# EasyEDA Pro project 第十四届蓝桥杯省赛真题.eprj, board B1
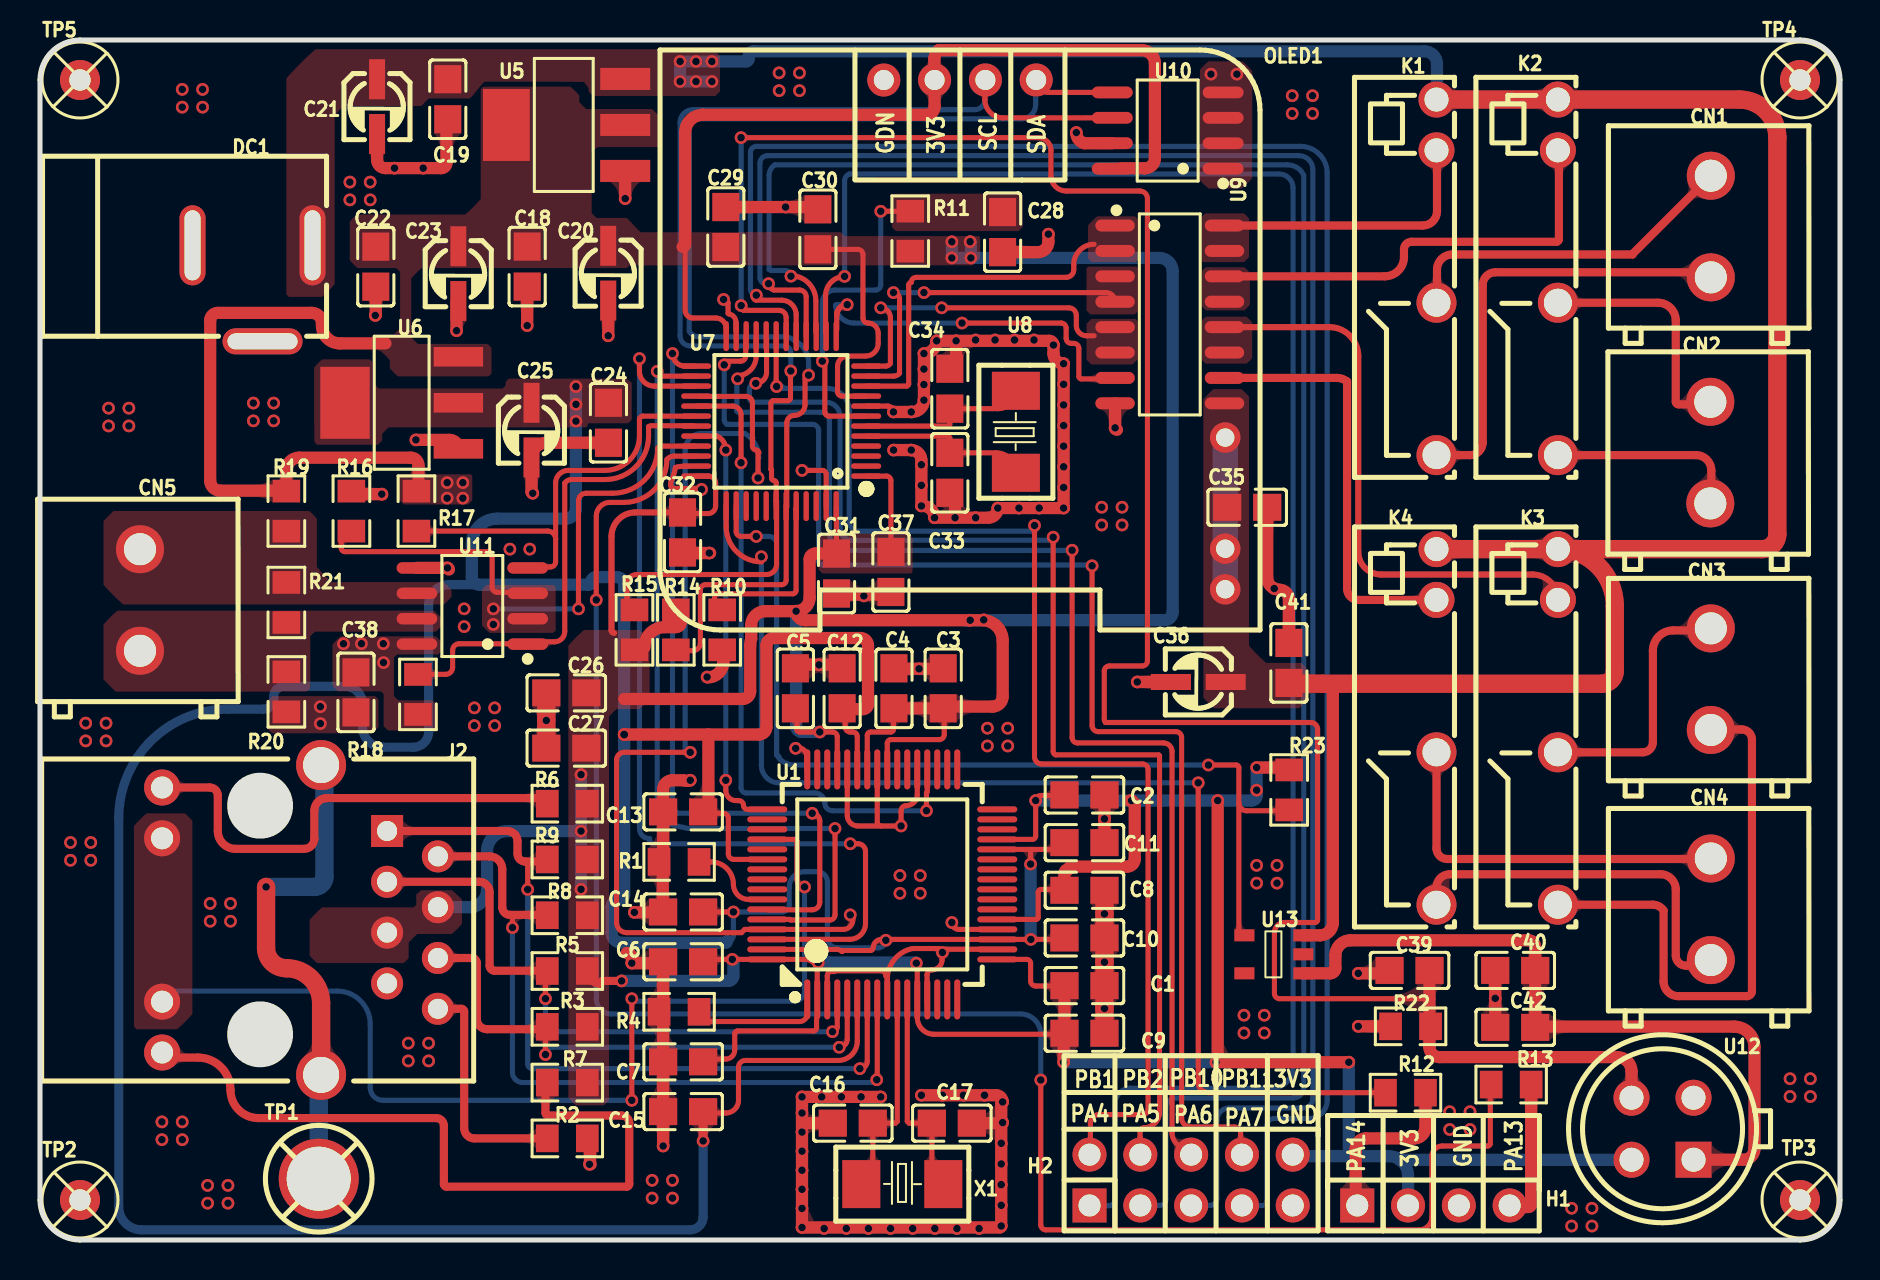
[diagram p2: board, top side]
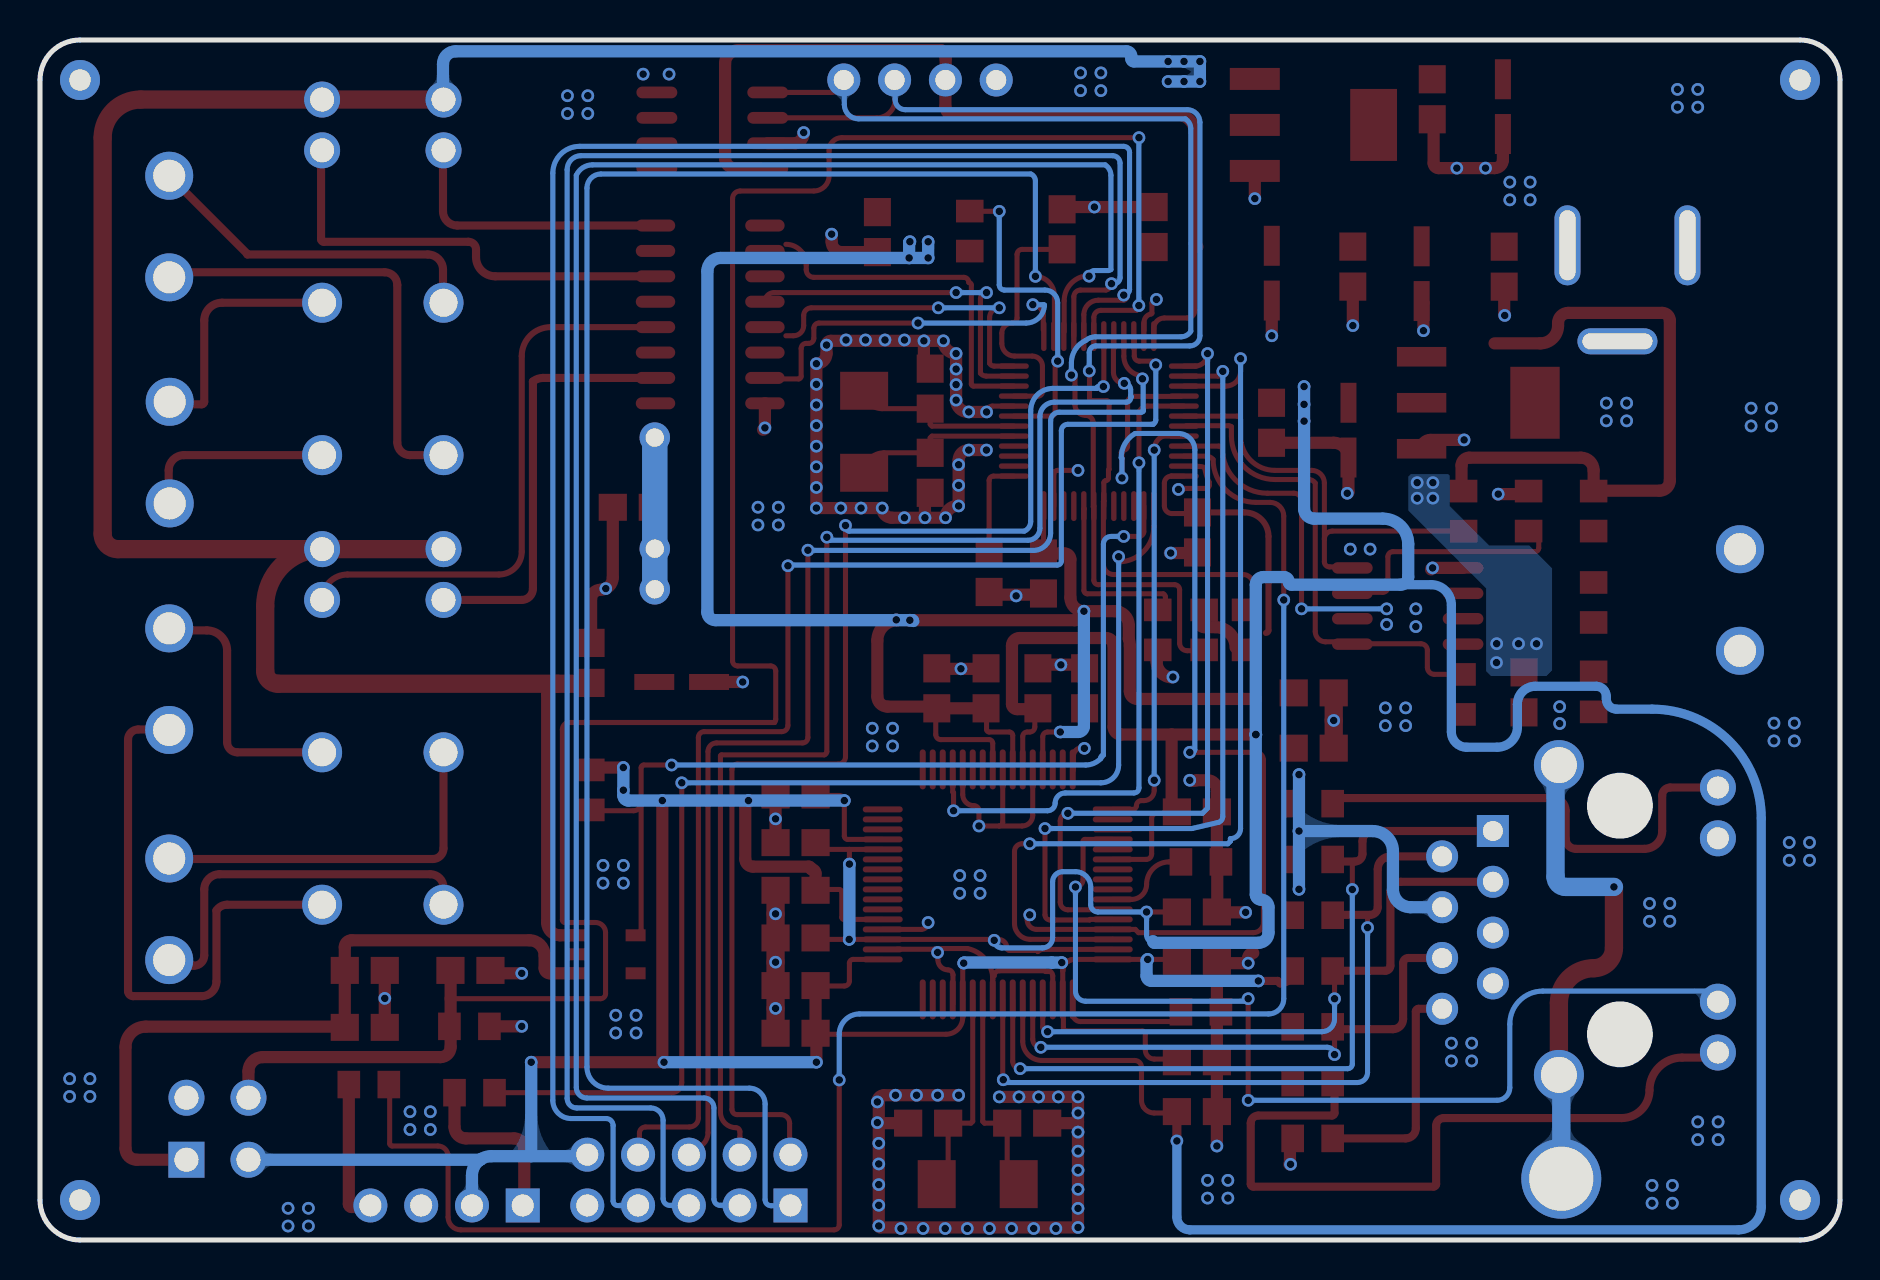
[diagram p3: board, bottom side, seen from below]

Outline 90 x 60 mm; copper layers: Top Layer, Bottom Layer. Coordinates in mm from the lower left corner of the outline.
Outline path: 0,58 0,2 arc(0.59,0.59) 2,0 88,0 arc(89.41,0.59) 90,2 90,58 arc(89.41,59.41) 88,60 2,60 arc(0.59,59.41) 0,58
Stack: Top Layer 0.035mm / Dielectric1 1.51mm FR4 er 4.5 / Bottom Layer 0.035mm

## Design rules (mm)
net XO: DP1
net XI: DP1
net M_X1: DP2
net M_X2: DP2
template: 用户自定义配置
spacing safeClearance (default): track to track 0.203, other pairs 0.152 to 0.203
track width trackWidth (default): min 0.254, default 0.254, max 2.54
track width PWR: min 0.254, default 0.61, max 2.54
differential pair differentialPair (default): width min 0.127, default 0.254, max 2.54; gap min 0.152, default 0.152
via viaSize (default): diameter min 0.635, default 0.635, max 10; hole min 0.381, default 0.381, max 5.999
net 3V3 uses PWR
net GND uses PWR
net 1V8 uses PWR
net DC uses PWR

## Placement (name value [footprint] x y rotation side)
C1  100nF  [C0805]  52.22 12.72 0 top
C2  100nF  [C0805]  52.22 22.25 0 top
C3  100nF  [C0805]  45.16 27.58 90 top
C4  100nF  [C0805]  42.7 27.58 90 top
C5  100nF  [C0805]  37.77 27.58 90 top
C6  100nF  [C0805]  32.16 13.91 180 top
C7  100nF  [C0805]  32.16 8.91 180 top
C8  100nF  [C0805]  52.22 17.49 0 top
C9  100nF  [C0805]  52.22 10.34 0 top
C10  100nF  [C0805]  52.22 15.1 0 top
C11  100nF  [C0805]  52.22 19.87 0 top
C12  100nF  [C0805]  40.11 27.58 90 top
C13  100nF  [C0805]  32.16 21.41 180 top
C14  100nF  [C0805]  32.16 16.4 180 top
C15  100nF  [C0805]  32.16 6.42 180 top
C16  20pF  [C0805]  40.64 5.84 0 top
C17  20pF  [C0805]  45.59 5.84 180 top
C18  100nF  [C0805]  24.36 48.67 270 top
C19  100nF  [C0805]  20.39 57.04 270 top
C20  10uF  [C_Ele_SMD_3x5.4mm]  28.4 48.34 90 top
C21  10uF  [C_Ele_SMD_3x5.4mm]  16.84 56.66 90 top
C22  100nF  [C0805]  16.79 48.67 270 top
C23  10uF  [C_Ele_SMD_3x5.4mm]  20.9 48.31 90 top
C24  100nF  [C0805]  28.42 40.86 270 top
C25  10uF  [C_Ele_SMD_3x5.4mm]  24.56 40.49 90 top
C26  100nF  [C0805]  26.31 27.36 180 top
C27  10nF  [C0805]  26.31 24.59 180 top
C28  100nF  [C0805]  48.13 50.39 270 top
C29  100nF  [C0805]  34.29 50.65 90 top
C30  100nF  [C0805]  38.89 50.53 90 top
C31  100nF  [C0805]  39.83 33.33 270 top
C32  100nF  [C0805]  32.13 35.38 270 top
C33  20p  [C0805]  45.49 38.36 90 top
C34  20p  [C0805]  45.49 42.57 270 top
C35  100nF  [C0805]  60.36 36.64 0 top
C36  10uF  [C_Ele_SMD_3x5.4mm]  57.91 27.91 0 top
C37  100nF  [C0805]  42.54 33.4 90 top
C38  100nF  [C0805]  15.8 27.38 90 top
C39  100nF  [C0805]  68.48 13.48 180 top
C40  100nF  [C0805]  73.76 13.48 0 top
C41  100nF  [C0805]  62.44 28.85 90 top
C42  10nF  [C0805]  73.76 10.63 0 top
CN1  KF128L-5.08-2P 蓝色  [TH_KF128L-5.08-2P]  83.54 50.67 270 top
CN2  KF128L-5.08-2P 蓝色  [TH_KF128L-5.08-2P]  83.51 39.37 270 top
CN3  KF128L-5.08-2P 蓝色  [TH_KF128L-5.08-2P]  83.54 28.04 270 top
CN4  KF128L-5.08-2P 蓝色  [TH_KF128L-5.08-2P]  83.54 16.54 270 top
CN5  KF128L-5.08-2P 蓝色  [TH_KF128L-5.08-2P]  5 32 270 top
DC1  -  [DC-2.0]  10.5 50 180 top
H1  -  [HDR-TH_4P-P2.54-V-F]  69.67 1.73 0 top
H2  -  [HDR-TH_10P-P2.54-V-M-R2-C5-S2.54]  57.56 3 0 top
J2  HY911105AE  [RJ45-TH_HR911105A]  13 16 270 top
K1  HF49FD/012-1H12  [RELAY-TH_HF49FD-XXX-1H12-XXX]  69.82 48.13 270 top
K2  HF49FD/012-1H12  [RELAY-TH_HF49FD-XXX-1H12-XXX]  75.9 48.13 270 top
K3  HF49FD/012-1H12  [RELAY-TH_HF49FD-XXX-1H12-XXX]  75.9 25.65 270 top
K4  HF49FD/012-1H12  [RELAY-TH_HF49FD-XXX-1H12-XXX]  69.82 25.65 270 top
NOREF  -  [Pad_e674]  59.26 32.54 0 top
NOREF#2  -  [Pad_e675]  59.26 40.12 0 top
NOREF#3  -  [Pad_e663]  59.26 34.57 0 top
OLED1  -  [0.96OLED_4P]  46 58 0 top
R1  0R  [R0805]  31.95 18.9 180 top
R2  0R  [R0805]  26.37 5.08 0 top
R3  49R9  [R0805]  26.37 10.66 0 top
R4  12K  [R0805]  31.95 11.41 180 top
R5  49R9  [R0805]  26.37 13.45 0 top
R6  300R  [R0805]  26.37 21.82 0 top
R7  300R  [R0805]  26.37 7.87 0 top
R8  49R9  [R0805]  26.37 16.24 0 top
R9  49R9  [R0805]  26.37 19.03 0 top
R10  10K  [R0805]  34.11 30.51 90 top
R11  12K  [R0805]  43.51 50.45 270 top
R12  100R  [R0805]  68.28 7.37 180 top
R13  100R  [R0805]  73.56 7.77 180 top
R14  10K  [R0805]  31.79 30.51 90 top
R15  10K  [R0805]  29.72 30.51 90 top
R16  12K  [R0805]  15.57 36.45 90 top
R17  12K  [R0805]  18.82 36.45 90 top
R18  12K  [R0805]  18.9 27.28 90 top
R19  NC  [R0805]  12.32 36.45 90 top
R20  NC  [R0805]  12.32 27.41 90 top
R21  NC  [R0805]  12.32 31.88 90 top
R22  10K  [R0805]  68.53 10.68 180 top
R23  10K  [R0805]  62.46 22.5 270 top
TP1  -  [M3螺丝]  14 3 0 top
TP2  -  [M2螺丝]  2 2 0 top
TP3  -  [M2螺丝]  88 2 0 top
TP4  -  [M2螺丝]  88 58 0 top
TP5  -  [M2螺丝]  2 58 0 top
U1  CH395Q  [LQFP-64_L10.0-W10.0-P0.50-LS12.0-BL]  42.11 17.78 0 top
U5  AMS1117-3.3  [SOT-223-3_L6.5-W3.4-P2.30-LS7.0-BR]  26.29 55.75 0 top
U6  AMS1117-1.8  [SOT-223-4_L6.5-W3.5-P2.30-LS7.0-BR]  18.08 41.86 0 top
U7  GD32F303CBT6  [LQFP-48_L7.0-W7.0-P0.50-LS9.0-BL]  37.06 40.94 90 top
U8  8M-5032-2P  [CRYSTAL-SMD_L5.0-W3.2]  48.79 40.41 270 top
U9  ULN2003  [SOIC-16_L9.9-W3.9-P1.27-LS6.0-BL]  56.49 46.28 270 top
U10  M24C02-WMN6TP  [SOIC-8_L4.9-W3.9-P1.27-LS6.0-BL]  56.38 55.47 90 top
U11  MAX3485ESA  [SOP-8_L5.0-W4.0-P1.27-LS6.0-BL]  21.62 31.7 90 top
U12  MP-2  [SENSOR-TH_MP-5]  81.13 5.56 90 top
U13  -  [SOT_PDS]  63.17 13.33 90 top
X1  30MHz  [OSC-SMD_L5.0-W3.2]  43.12 2.79 180 top

## Footprints (pads in the part's own frame, mm; a bottom-side part is the same pattern mirrored in y, then rotated)
0.96OLED_4P
  round 1.65 hole 1: 1(-3.81,-0.002) 2(-1.27,0.002) 3(1.27,0.002) 4(3.81,0.002)
C0805
  rect 1.41x1.35 smd: 1(-1,0) 2(1,0)
C_Ele_SMD_3x5.4mm
  rect 1.999x0.8 smd: 1(1.374,-0.014) 2(-1.364,-0.014)
CRYSTAL-SMD_L5.0-W3.2
  rect 1.9x2.4 smd: 1(-2.05,0) 2(2.05,0)
DC-2.0
  oval 4x1.3 hole 3.5x0.8: 2(-0.627,5.067)
  oval 1.3x4 hole 0.8x3.5: 3(2.873,0.267) 4(-3.127,0.267)
HDR-TH_4P-P2.54-V-F
  rect 1.7x1.7 hole 1.1: 1(-3.81,0)
  round 1.7 hole 1.1: 2(-1.27,0) 3(1.27,0) 4(3.81,0)
HDR-TH_10P-P2.54-V-M-R2-C5-S2.54
  rect 1.7x1.7 hole 1.1: 1(-5.08,-1.27)
  round 1.7 hole 1.1: 2(-5.08,1.27) 3(-2.54,-1.27) 4(-2.54,1.27) 5(0,-1.27) 6(0,1.27) 7(2.54,-1.27) 8(2.54,1.27) 9(5.08,-1.27) 10(5.08,1.27)
LQFP-48_L7.0-W7.0-P0.50-LS9.0-BL
  oval 0.27x1.5 smd: 1(-2.75,-4.25) 2(-2.25,-4.25) 3(-1.75,-4.25) 4(-1.25,-4.25) 5(-0.75,-4.25) 6(-0.25,-4.25) 7(0.25,-4.25) 8(0.75,-4.25) 9(1.25,-4.25) 10(1.75,-4.25) 11(2.25,-4.25) 12(2.75,-4.25) 25(2.75,4.25) 26(2.25,4.25) 27(1.75,4.25) 28(1.25,4.25) 29(0.75,4.25) 30(0.25,4.25) 31(-0.25,4.25) 32(-0.75,4.25) 33(-1.25,4.25) 34(-1.75,4.25) 35(-2.25,4.25) 36(-2.75,4.25)
  oval 1.5x0.27 smd: 13(4.25,-2.75) 14(4.25,-2.25) 15(4.25,-1.75) 16(4.25,-1.25) 17(4.25,-0.75) 18(4.25,-0.25) 19(4.25,0.25) 20(4.25,0.75) 21(4.25,1.25) 22(4.25,1.75) 23(4.25,2.25) 24(4.25,2.75) 37(-4.25,2.75) 38(-4.25,2.25) 39(-4.25,1.75) 40(-4.25,1.25) 41(-4.25,0.75) 42(-4.25,0.25) 43(-4.25,-0.25) 44(-4.25,-0.75) 45(-4.25,-1.25) 46(-4.25,-1.75) 47(-4.25,-2.25) 48(-4.25,-2.75)
LQFP-64_L10.0-W10.0-P0.50-LS12.0-BL
  oval 0.3x2 smd: 1(-3.75,-5.75) 2(-3.25,-5.75) 3(-2.75,-5.75) 4(-2.25,-5.75) 5(-1.75,-5.75) 6(-1.25,-5.75) 7(-0.75,-5.75) 8(-0.25,-5.75) 9(0.25,-5.75) 10(0.75,-5.75) 11(1.25,-5.75) 12(1.75,-5.75) 13(2.25,-5.75) 14(2.75,-5.75) 15(3.25,-5.75) 16(3.75,-5.75) 33(3.75,5.75) 34(3.25,5.75) 35(2.75,5.75) 36(2.25,5.75) 37(1.75,5.75) 38(1.25,5.75) 39(0.75,5.75) 40(0.25,5.75) 41(-0.25,5.75) 42(-0.75,5.75) 43(-1.25,5.75) 44(-1.75,5.75) 45(-2.25,5.75) 46(-2.75,5.75) 47(-3.25,5.75) 48(-3.75,5.75)
  oval 2x0.3 smd: 17(5.75,-3.75) 18(5.75,-3.25) 19(5.75,-2.75) 20(5.75,-2.25) 21(5.75,-1.75) 22(5.75,-1.25) 23(5.75,-0.75) 24(5.75,-0.25) 25(5.75,0.25) 26(5.75,0.75) 27(5.75,1.25) 28(5.75,1.75) 29(5.75,2.25) 30(5.75,2.75) 31(5.75,3.25) 32(5.75,3.75) 49(-5.75,3.75) 50(-5.75,3.25) 51(-5.75,2.75) 52(-5.75,2.25) 53(-5.75,1.75) 54(-5.75,1.25) 55(-5.75,0.75) 56(-5.75,0.25) 57(-5.75,-0.25) 58(-5.75,-0.75) 59(-5.75,-1.25) 60(-5.75,-1.75) 61(-5.75,-2.25) 62(-5.75,-2.75) 63(-5.75,-3.25) 64(-5.75,-3.75)
M2螺丝
  round 2 hole 1.07: 1(0,0)
M3螺丝
  round 4 hole 3.2: 1(-0.064,0.064)
OSC-SMD_L5.0-W3.2
  rect 1.9x2.4 smd: 1(-2.05,0) 2(2.05,0)
Pad_e663
  round 1.524 hole 0.914: 65(0,0)
Pad_e674
  round 1.524 hole 0.914: 66(0,0)
Pad_e675
  round 1.524 hole 0.914: 67(0,0)
R0805
  rect 1.133x1.377 smd: 1(-1,0) 2(1,0)
RELAY-TH_HF49FD-XXX-1H12-XXX
  round 1.8 hole 1.2: 1(-8.89,0) 2(-6.35,0)
  round 2 hole 1.4: 3(1.27,0) 4(8.89,0)
RJ45-TH_HR911105A
  rect 1.6x1.6 hole 1: 1(-4.45,4.355)
  round 1.6 hole 1: 2(-3.18,6.895) 3(-1.91,4.355) 4(-0.64,6.895) 5(0.63,4.355) 6(1.9,6.895) 7(3.17,4.355) 8(4.44,6.895)
  round 1.8 hole 1.1: 9(-6.625,-6.895) 10(-4.085,-6.895) 11(4.085,-6.895) 12(6.625,-6.895)
  round 2.5 hole 1.8: SH1(-7.745,1.055) SH2(7.745,1.055)
SENSOR-TH_MP-5
  rect 1.8x1.8 hole 1.2: 1(-1.549,-1.55)
  round 1.8 hole 1.2: 2(1.55,-1.55) 3(-1.55,1.55) 4(1.55,1.55)
SOIC-8_L4.9-W3.9-P1.27-LS6.0-BL
  oval 0.588x2.045 smd: 1(-1.905,-2.772) 2(-0.635,-2.772) 3(0.635,-2.772) 4(1.905,-2.772) 5(1.905,2.772) 6(0.635,2.772) 7(-0.635,2.772) 8(-1.905,2.772)
SOIC-16_L9.9-W3.9-P1.27-LS6.0-BL
  oval 0.602x1.971 smd: 1(-4.445,-2.736) 2(-3.175,-2.736) 3(-1.905,-2.736) 4(-0.635,-2.736) 5(0.635,-2.736) 6(1.905,-2.736) 7(3.175,-2.736) 8(4.445,-2.736) 9(4.445,2.736) 10(3.175,2.736) 11(1.905,2.736) 12(0.635,2.736) 13(-0.635,2.736) 14(-1.905,2.736) 15(-3.175,2.736) 16(-4.445,2.736)
SOP-8_L5.0-W4.0-P1.27-LS6.0-BL
  oval 0.574x2.035 smd: 1(-1.905,-2.768) 2(-0.635,-2.768) 3(0.635,-2.768) 4(1.905,-2.768) 5(1.905,2.768) 6(0.635,2.768) 7(-0.635,2.768) 8(-1.905,2.768)
SOT-223-3_L6.5-W3.4-P2.30-LS7.0-BR
  rect 2.5x1.1 smd: 1(2.97,-2.3) 2(2.97,0) 3(2.97,2.3)
  rect 2.34x3.6 smd: 4(-2.97,0)
SOT-223-4_L6.5-W3.5-P2.30-LS7.0-BR
  rect 2.47x0.98 smd: 1(2.835,-2.3) 2(2.835,0) 3(2.835,2.3)
  rect 2.47x3.6 smd: 4(-2.835,0)
SOT_PDS
  rect 0.6x1 smd: 1(0,0) 2(0.95,0) 3(1.9,0) 4(1.9,2.95) 5(0,2.95)
TH_KF128L-5.08-2P
  round 2.4 hole 1.6: 1(-2.54,0) 2(2.54,0)

## Nets
As in the schematic, except:
3V3: C1.1 C2.1 C3.1 C4.1 C5.1 C6.1 C7.1 C8.1 C9.1 C18.1 C20.1 C22.1 C23.1 C26.1 C27.1 C29.1 C30.1 C31.1 C32.1 C37.2 C38.2 H1.2 H2.10 J2.4 J2.5 OLED1.2 R3.2 R5.2 R6.2 R7.2 R8.2 R9.2 R11.2 R14.2 R15.1 R17.2 R18.1 R19.2 R23.1 U1.2 U1.12 U1.17 U1.21 U1.29 U1.40 U1.42 U1.45 U1.64 U5.2 U5.4 U6.3 U7.1 U7.9 U7.24 U7.36 U7.48 U10.8 U11.8 U12.3
GND: C1.2 C2.2 C3.2 C4.2 C5.2 C6.2 C7.2 C8.2 C9.2 C10.2 C11.2 C12.2 C13.2 C14.2 C15.2 C16.1 C17.1 C18.2 C19.2 C20.2 C21.2 C22.2 C23.2 C24.2 C25.2 C26.2 C27.2 C28.2 C29.2 C30.2 C31.2 C32.2 C33.1 C34.1 C35.2 C36.2 C37.1 C38.1 C39.2 C40.1 C41.2 C42.1 DC1.2 DC1.3 H1.3 H2.9 OLED1.1 R1.2 R2.2 R4.2 R10.1 R16.2 R20.1 R22.2 TP2.1 TP3.1 TP4.1 TP5.1 U1.3 U1.9 U1.13 U1.18 U1.20 U1.37 U1.41 U1.44 U1.48 U5.1 U6.1 U7.8 U7.23 U7.35 U7.47 U9.8 U10.1 U10.2 U10.3 U10.4 U10.7 U11.5 U12.2 U13.2
DC: C19.1 C21.1 C35.1 C36.1 C41.1 DC1.4 K1.1 K2.1 K3.1 K4.1 NOREF.66 NOREF#2.67 NOREF#3.65 U5.3 U9.9 U13.3
M_SCL: OLED1.3 R15.2 U7.42 U10.6
M_SDA: OLED1.4 R14.1 U7.43 U10.5

Pads without a net: J2 7; U1 14 15 16 22 23 24 25 26 27 30 31 32 33 34 35 38 39 46 47 50 51 53 55 56 57; U7 2 3 4 39 40 41 45 46; U13 5

## Via types
v1: diameter 0.635, hole 0.381, Top Layer to Bottom Layer, 306 vias

## Routing (per net, layer and track width the routed paths; a pad name or vN(x,y) marks a point on that pad's centre or on a via; arc(x,y) is an arc through that point)
1V8: length 218.5
  Top Layer w0.254: U1.28 49.53,19.53 ; 49.53,19.53 v1(49.53,18.8) ; 49.53,19.53 50.88,19.53 arc(51.12,19.63) C11.1 ; U1.63 39.83,14.53 arc(39.98,14.5) 40.11,14.42 arc(40.13,14.46) 40.16,14.48 41.53,14.48 arc(41.62,14.52) 41.66,14.61 arc(41.78,14.91) 42.08,15.03 U1.19 v1(49.54,15.03) 51.15,15.03 arc(51.2,15.05) C10.1 ; U1.54 34.69,19.03 arc(34.5,19.11) 34.42,19.3 34.42,21.08 arc(34.34,21.26) 34.16,21.34 33.23,21.34 arc(33.18,21.36) C13.1 ; C14.1 v1(34.67,16.4) ; 40.26,26.54 40.26,25.65 arc(40.33,25.47) 40.51,25.4 40.64,25.4 arc(40.8,25.33) 40.86,25.18 U1.43 ; U1.6 40.86,9.94 arc(40.58,9.26) 39.9,8.98 35.27,8.98 arc(35.02,8.88) 34.93,8.64 34.93,6.99 arc(34.9,6.81) 34.83,6.65 arc(34.6,6.43) 34.29,6.35 33.23,6.35 arc(33.18,6.37) C15.1
  Top Layer w0.457: C15.1 v1(33.16,4.95)
  Top Layer w0.61: 33.42,25.27 33.42,21.53 arc(33.36,21.39) 33.23,21.34 ; 33.42,25.27 35.94,25.27 arc(36.21,25.38) 36.32,25.65 36.32,29.72 arc(36.43,29.99) 36.7,30.1 41.02,30.1 arc(41.29,29.99) 41.4,29.72 41.4,26.8 arc(41.33,26.62) 41.15,26.54 40.15,26.54 arc(40.12,26.56) C12.1 ; 33.42,25.27 v1(29.21,25.27)
  Bottom Layer w0.254: v1(42.29,14.99) arc(42.18,14.72) 41.91,14.61 39.88,14.61 arc(39.52,14.75) 39.37,15.11 39.37,17.91 arc(39.22,18.27) 38.86,18.42 38.23,18.42 arc(37.69,18.19) 37.47,17.65 37.47,16.76 arc(37.36,16.51) 37.1,16.4 v1(34.67,16.4) 34.67,15.26 arc(34.55,14.98) 34.27,14.86
  Bottom Layer w0.457: v1(33.16,4.95) 33.16,1.15 arc(32.97,0.7) 32.51,0.51 5.08,0.51 arc(4.27,0.84) 3.94,1.65 3.94,21.08 arc(5.54,24.94) 9.4,26.54 11.18,26.54 arc(11.54,26.69) 11.68,27.05 11.68,27.18 arc(11.83,27.54) 12.19,27.69 15.24,27.69 arc(15.87,27.43) 16.13,26.8 16.13,25.65 arc(16.43,24.94) 17.14,24.64 18.67,24.64 arc(19.21,24.86) 19.43,25.4 19.43,31.75 arc(19.73,32.47) 20.45,32.77 21.97,32.77
  Bottom Layer w0.61: v1(49.53,18.8) 49.53,15.04 arc(49.53,15.03) v1(49.54,15.03) ; v1(26.8,42.67) v1(26.8,41.78) v1(26.8,40.94) 26.8,36.58 arc(26.65,36.22) 26.29,36.07 22.86,36.07 arc(21.96,35.7) 21.59,34.8 21.59,33.15 arc(21.7,32.88) 21.97,32.77 27.43,32.77 arc(27.52,32.8) 27.56,32.89 arc(27.63,33.07) 27.81,33.15 28.83,33.15 arc(29.1,33.04) 29.21,32.77 v1(29.21,25.27) 29.21,17.27 arc(29.14,17.09) 28.96,17.02 arc(28.69,16.91) 28.57,16.64 28.57,15.37 arc(28.72,15.01) 29.08,14.86 34.27,14.86 arc(34.33,14.88) 34.35,14.94
3V3: length 361.5
  Top Layer w0.254: 34.31,45.19 34.31,45.57 arc(34.15,45.95) 33.78,46.1 32.64,46.1 arc(32.37,46.21) 32.26,46.48 32.26,49.78 ; 38.83,11.07 38.83,10.6 arc(38.79,10.5) 38.68,10.45 34.88,10.45 arc(34.78,10.41) 34.74,10.31 34.74,9.5 arc(34.6,9.18) 34.28,9.05 33.51,9.05 ; U1.29 49.62,20.03 arc(49.74,20.08) 49.78,20.19 v1(49.78,21.97) arc(49.86,22.15) 50.04,22.22 51.2,22.22 arc(51.22,22.23) C2.1 ; 38.86,13.46 38.86,13.82 arc(38.88,13.86) v1(38.91,13.87) ; 38.86,13.46 38.86,12.03 ; 38.86,13.46 arc(38.8,13.72) 38.63,13.92 ; 38.86,13.46 arc(38.8,13.72) 38.63,13.92 ; 39.82,36.58 39.82,34.33 arc(39.82,34.33) C31.1 ; U1.21 49.81,16.03 arc(49.88,16.06) 49.91,16.13 49.91,17.4 arc(49.95,17.49) 50.04,17.53 51.18,17.53 arc(51.21,17.51) C8.1 ; 41.31,42.19 40.1,42.19 arc(39.94,42.26) 39.88,42.42 39.88,43.69 arc(40.03,44.05) 40.39,44.2 41.28,44.2 arc(41.72,44.38) 41.91,44.83 41.91,45.34 arc(41.76,45.7) 41.4,45.85 arc(41.22,45.92) 41.15,46.1 41.15,49.28 arc(41.07,49.46) 40.89,49.53 38.9,49.53 arc(38.9,49.53) C30.1 ; U1.42 41.36,25.23 arc(41.41,25.35) 41.53,25.4 42.54,25.4 arc(42.63,25.44) 42.67,25.53 42.67,26.56 arc(42.68,26.58) C4.1 ; 41.31,38.19 42.32,38.19 arc(42.48,38.13) 42.54,37.97 C37.2 ; U1.17 49.34,14.03 arc(49.48,13.98) 49.53,13.84 49.53,12.95 arc(49.6,12.77) 49.78,12.7 51.2,12.7 arc(51.22,12.71) C1.1 ; U1.45 39.86,25.16 arc(39.79,25.33) 39.62,25.4 v1(38.99,25.4) 37.97,25.4 arc(37.88,25.44) 37.85,25.53 37.85,26.51 arc(37.82,26.56) C5.1 ; 32.81,38.19 33.43,38.19 arc(33.68,38.09) 33.78,37.85 33.78,36.7 arc(33.67,36.43) 33.4,36.32 32.18,36.32 arc(32.14,36.34) C32.1 ; 38.29,14.03 U1.64 v1(34.62,14.03) 33.27,14.03 arc(33.19,14) C6.1 ; 38.29,14.03 arc(38.47,14) 38.63,13.92 ; 38.29,14.03 arc(38.47,14) 38.63,13.92 ; U1.40 42.36,24.84 arc(42.42,24.97) 42.54,25.02 44.96,25.02 arc(45.14,25.09) 45.21,25.27 45.21,26.53 arc(45.2,26.57) C3.1 ; v1(43.81,13.84) arc(43.85,13.83) 43.86,13.79 U1.12 43.86,11.13 arc(44.11,10.53) 44.7,10.29 51.17,10.29 arc(51.18,10.29) 51.18,10.29
  Top Layer w0.305: C32.1 29.77,36.38 arc(28.93,36.03) 28.57,35.18 28.57,30.48 arc(28.61,30.39) 28.7,30.35
  Top Layer w0.406: v1(29.08,12.95) 28.11,12.95 27.99,12.83 arc(27.55,13.01) R5.2
  Top Layer w0.61: v1(37.8,31.44) 36.27,31.44 arc(35.77,31.23) 35.56,30.73 35.56,30.06 arc(35.52,29.89) 35.51,29.72 35.51,27.43 arc(35.4,27.16) 35.13,27.05 29.21,27.05 ; v1(37.8,31.44) arc(37.94,31.12) 38.26,30.99 v1(46.51,30.99) 47.12,30.99 arc(47.84,30.69) 48.13,29.97 48.13,27.18 arc(47.98,26.82) 47.62,26.67 45.25,26.67 arc(45.19,26.64) C3.1 C4.1 ; v1(37.8,31.44) arc(38.28,31.64) 38.48,32.12 38.48,34.04 arc(38.57,34.24) 38.77,34.33 C31.1 ; OLED1.2 44.73,56.67 arc(44.61,56.38) 44.32,56.26 33.15,56.26 arc(32.52,56) 32.26,55.37 32.26,49.78 arc(32.22,49.69) 32.13,49.66 ; v1(51.18,8.89) 51.18,10.3 arc(51.19,10.33) C9.1 C1.1 ; 17.27,44.83 14.99,44.83 arc(14.36,45.09) 14.1,45.72 14.1,45.85 arc(13.95,46.21) 13.59,46.36 8.89,46.36 arc(8.62,46.24) 8.51,45.97 8.51,37.97 arc(8.66,37.61) 9.02,37.47 12.3,37.47 arc(12.31,37.46) R19.2 12.32,38.48 arc(12.5,38.93) 12.95,39.12 18.54,39.12 arc(18.81,39) 18.92,38.73 18.92,37.55 arc(18.89,37.48) R17.2 ; 44.72,58.18 44.72,59.03 arc(44.78,59.29) 44.94,59.49 55.08,59.49 arc(55.55,59.3) 55.75,58.83 55.75,54.09 arc(55.6,53.73) 55.24,53.59 54.04,53.59 ; v1(60.83,23.62) 62.34,23.62 arc(62.42,23.59) R23.1 ; 32.05,31.49 32.05,30.91 arc(31.97,30.72) 31.78,30.64 31.23,30.64 arc(30.52,30.35) 30.22,29.63 ; C8.1 51.22,18.33 arc(51.28,18.48) 51.44,18.54 arc(51.47,18.63) 51.56,18.67 54.36,18.67 arc(54.63,18.78) 54.74,19.05 54.74,21.72 arc(54.66,21.9) 54.48,21.97 ; v1(65.44,8.89) v1(58.8,8.89) arc(58.86,8.91) 58.88,8.97 v1(58.88,21.97)
  Bottom Layer w0.61: v1(38.99,25.4) 38.1,25.4 arc(37.89,25.49) 37.8,25.7 v1(37.8,31.44) ; v1(45.59,49.91) v1(45.59,49.1) v1(46.54,49.1) ; v1(27.05,20.45) v1(27.05,23.27) ; v1(27.05,20.45) 23.37,20.45 arc(22.65,20.15) 22.35,19.43 22.35,17.53 arc(22.09,16.9) 21.47,16.64 J2.4 ; v1(27.05,20.45) v1(27.05,17.53) ; v1(49.78,21.97) v1(54.58,21.97) v1(58.88,21.97) 60.58,21.97 arc(60.76,22.05) 60.83,22.22 v1(60.83,23.62) ; v1(38.91,13.87) 39.41,13.87 arc(39.41,13.87) 39.41,13.88 43.78,13.88 v1(43.81,13.84) ; v1(29.08,12.95) 34.42,12.95 arc(34.6,13.03) 34.67,13.21 34.67,13.97 arc(34.65,14.01) v1(34.62,14.03) ; H1.2 68.4,3.23 arc(68.29,3.67) 68,4.01 ; 65.44,4.19 62.71,4.19 arc(62.66,4.21) H2.10 ; 65.44,4.19 v1(65.44,8.89) ; 65.44,4.19 67.44,4.19 arc(67.71,4.15) 67.96,4.03 arc(67.97,4.02) 67.99,4.01 68,4.01 ; v1(46.54,49.1) 46.54,49.88 arc(46.53,49.9) v1(46.51,49.92) ; v1(46.54,49.1) 55.97,49.1 arc(56.44,48.91) 56.63,48.44 56.63,31.4 arc(56.51,31.11) 56.23,30.99 46.38,30.99 arc(46.35,30.98) 46.33,30.95 ; 79.58,4.01 68,4.01 ; v1(58.8,8.89) v1(51.18,8.89)
  vias: v1(15.18,29.81) v1(16.07,29.82) v1(17.17,29.82) v1(17.18,28.87) v1(20.36,37.87) v1(20.36,37.09) v1(21.14,37.87) v1(21.14,37.09) v1(47.19,31.01) v1(60.83,22.49)
GND: length 207
  Top Layer w0.254: 32.4,38.68 32.04,38.68 arc(31.9,38.67) 31.77,38.63 arc(31.68,38.25) 31.54,37.88 31.54,37.73 arc(31.58,37.62) 31.69,37.58 32.97,37.58 arc(33.12,37.52) 33.18,37.38 ; U7.47 39.31,38.29 arc(39.25,38.42) 39.12,38.48 v1(38.1,38.48) ; U1.44 40.36,21.23 arc(40.52,20.86) 40.89,20.7 42.04,20.7 ; U1.20 45.94,15.53 arc(45.69,15.63) v1(45.59,15.88) ; 42.36,13.03 U1.9 ; 42.36,13.03 42.36,13.14 arc(42.34,13.19) 42.29,13.21 arc(42.22,13.39) 42.04,13.46 39.75,13.46 arc(39.74,13.44) 39.71,13.42 39.49,13.42 arc(39.4,13.33) 39.36,13.2 U1.3 ; 42.36,13.03 arc(42.72,14.02) 43.62,14.57 44.93,14.57 arc(45.05,14.53) 45.12,14.42 ; 42.04,20.7 v1(43.05,20.7) 43.05,21.46 arc(43.13,21.64) 43.31,21.72 arc(43.7,21.88) 43.86,22.27 U1.37 ; 42.04,20.7 arc(41.91,20.75) 41.86,20.87 U1.41 ; 47.17,14.54 45.29,14.54 arc(45.18,14.51) 45.12,14.42 ; U7.8 42.38,41.69 arc(42.59,41.61) v1(42.67,41.4) ; 44.35,11.8 44.35,13.25 arc(44.42,13.43) 44.6,13.51 arc(44.96,13.65) 45.1,14.01 45.1,14.35 arc(45.11,14.39) 45.12,14.42 ; 38.33,23.49 38.33,24.18 arc(38.21,24.49) 37.9,24.62 ; 34.8,45.48 34.8,45.89 arc(34.7,46.16) 34.44,46.3 arc(34.42,46.32) 34.4,46.34 34.4,46.84 arc(34.36,46.95) 34.25,47 ; 45.12,14.42 arc(45.12,14.4) v1(45.12,14.38)
  Top Layer w0.61: v1(29.72,16.38) 31.14,16.38 ; 31.14,16.38 C14.2 ; 31.14,16.38 31.14,18.72 arc(31.08,18.85) R1.2 arc(31.1,18.96) 31.16,19.11 C13.2 31.16,22.52 arc(31.29,22.85) 31.62,22.99 32.17,22.99 arc(32.34,22.96) v1(32.51,22.99) ; 37.42,28.77 39.99,28.77 arc(40.06,28.74) 40.09,28.67 ; C2.2 v1(53.22,21.06) C11.2 ; v1(20.83,45.47) 20.83,46.86 C23.2 ; C17.1 48.06,5.84 ; 48.06,5.84 v1(48.06,4.84) v1(48.06,3.8) v1(48.06,2.77) v1(48.06,1.74) v1(48.06,0.7) arc(48.04,0.65) 47.99,0.63 v1(38.1,0.63) v1(38.1,1.58) v1(38.1,2.54) v1(38.1,3.49) v1(38.1,4.44) v1(38.1,5.4) 38.1,5.9 ; 48.06,5.84 48.1,5.84 arc(48.12,5.85) v1(48.13,5.87) ; 48.06,5.84 48.06,6.83 arc(48.08,6.88) v1(48.13,6.9) arc(48.03,7.14) 47.8,7.24 v1(47.22,7.24) v1(46.17,7.24) v1(45.12,7.24) v1(44.07,7.24) ; 16.85,55.3 16.85,54.01 arc(16.98,53.72) 17.27,53.59 v1(17.72,53.59) v1(19.16,53.59) 20.07,53.59 arc(20.25,53.67) 20.32,53.85 20.32,55.97 arc(20.34,56.02) C19.2 ; v1(18.8,40) 20.48,40 arc(20.79,39.88) U6.1 ; 38.1,5.9 v1(38.1,6.35) v1(38.1,7.16) v1(39.08,7.16) v1(40.07,7.16) v1(41.05,7.16) v1(42.04,7.16) ; 38.1,5.9 arc(38.12,5.86) 38.15,5.84 C16.1 ; 34.17,29.52 34.17,28.9 arc(33.94,28.36) 33.39,28.13 ; 33.51,34.35 32.39,34.35 arc(32.2,34.27) 32.12,34.08 ; 39.92,32.27 42.6,32.27 arc(42.63,32.26) 42.64,32.23 ; U11.5 v1(20.37,33.6) arc(20.42,33.58) 20.45,33.53 ; v1(65.91,10.68) R22.2 ; C29.2 v1(37.28,51.65) 38.78,51.65 arc(38.86,51.61) C30.2 ; 27.5,5.06 27.5,3.81 arc(27.51,3.79) 27.53,3.78 ; C20.2 v1(28.41,45.21) ; 29.26,53.45 v1(29.26,52.07) ; v1(45.75,36.11) v1(44.73,36.11) arc(44.55,36.53) 44.14,36.7 v1(44.07,36.7) v1(44.07,37.73) 44.07,38.99 arc(43.92,39.35) v1(43.56,39.5) v1(42.68,39.5) ; v1(45.75,36.11) 45.75,37.1 arc(45.68,37.28) C33.1 ; v1(45.75,36.11) v1(46.78,36.11) 47.41,36.11 arc(47.75,36.25) v1(47.89,36.6) v1(48.95,36.6) v1(49.96,36.6) v1(51.18,36.6) v1(51.18,37.63) v1(51.18,38.66) v1(51.18,39.69) v1(51.18,40.72) v1(51.18,41.75) v1(51.18,42.78) v1(51.18,43.81) arc(50.82,43.96) 50.67,44.32 v1(50.67,44.75) arc(50.61,44.9) 50.46,44.96 v1(45.8,44.96) ; C42.1 v1(72.76,12.08) C40.1 ; U9.8 v1(53.75,40.61) arc(53.78,40.54) 53.85,40.51 ; C24.2 25.31,39.86 arc(24.79,39.65) C25.2 24.58,37.4 arc(24.59,37.36) v1(24.64,37.34) ; C36.2 v1(54.86,27.9) ; v1(50.42,50.29) 50.42,49.91 arc(50.27,49.55) 49.9,49.39 C28.2 ; C18.2 v1(24.36,45.72) ; C41.2 62.44,32.04 arc(62.31,32.37) 61.98,32.51 arc(61.54,32.69) 61.36,33.13 C35.2 ; C22.2 16.79,46.25 arc(16.78,46.24) v1(16.76,46.23) ; v1(45.8,44.96) 45.8,43.88 arc(45.71,43.66) C34.1 ; v1(45.8,44.96) v1(44.83,44.96) arc(44.65,44.51) v1(44.2,44.32) v1(44.2,43.55) v1(44.2,42.77) v1(44.2,41.99) arc(44.02,41.58) 43.6,41.4 v1(43.56,41.4) v1(42.67,41.4) ; 45.15,28.56 v1(43.95,28.56) 42.78,28.56 ; 15.81,37.29 v1(17.09,37.29) arc(17.1,37.29) 17.11,37.27 ; v1(65.91,13.33) 67.33,13.33 arc(67.44,13.38) C39.2 ; v1(31.16,4.7) C15.2 C7.2 31.16,11.21 arc(31.1,11.35) R4.2 arc(31.1,11.47) 31.16,11.61 C6.2 arc(31.14,13.86) 31.09,13.84 v1(29.59,13.84) 29.59,14.1 arc(29.52,14.28) 29.34,14.35 ; U10.7 52.22,54.84 arc(51.92,55.03) v1(51.82,55.37)
  Top Layer w0.914: C26.2 v1(25.31,25.98) C27.2 ; C9.2 v1(53.22,11.58) C1.2 v1(53.22,13.89) C10.2 v1(53.22,16.31) C8.2
  vias: v1(1.52,19.88) v1(1.52,18.99) v1(2.29,25.84) v1(2.29,24.96) v1(2.54,19.88) v1(2.54,18.99) v1(3.3,25.84) v1(3.3,24.96) v1(3.43,41.59) v1(3.43,40.7) v1(4.44,41.59) v1(4.45,40.7) v1(6.1,5.91) v1(6.1,5.02) v1(7.11,57.53) v1(7.11,56.64) v1(7.11,5.91) v1(7.11,5.02) v1(8.13,57.53) v1(8.13,56.64) v1(8.38,2.73) v1(8.38,1.84) v1(8.51,16.83) v1(8.51,15.94) v1(9.4,2.73) v1(9.4,1.84) v1(9.52,16.83) v1(9.53,15.94) v1(10.67,41.85) v1(10.67,40.96) v1(11.68,41.85) v1(11.68,40.96) v1(14.02,26.67) v1(14.02,25.82) v1(15.49,52.9) v1(15.49,52.01) v1(16.51,52.9) v1(16.51,52.01) v1(18.41,9.84) v1(18.41,8.95) v1(19.43,9.84) v1(19.43,8.95) v1(21.21,31.56) v1(21.21,30.67) v1(21.72,26.61) v1(21.72,25.72) v1(22.73,26.61) v1(22.73,25.72) v1(23.5,34.54) v1(24.49,34.54) v1(27.47,3.78) v1(30.61,2.98) v1(30.61,2.1) v1(31.62,2.98) v1(31.62,2.1) v1(33.08,37.53) v1(33.35,28.15) v1(33.46,34.35) v1(34.18,47.03) v1(36.96,58.36) v1(36.96,57.47) v1(37.78,24.58) v1(37.97,58.36) v1(37.97,57.47) v1(38.95,28.76) v1(39.21,0.57) v1(40.31,0.57) v1(41.19,32.2) v1(41.42,0.57) v1(42.53,0.57) v1(43,18.22) v1(43,17.34) v1(43.63,0.57) v1(44.01,18.22) v1(44.01,17.34) v1(44.07,38.76) v1(44.74,0.57) v1(45.85,0.57) v1(46.78,45) v1(46.96,0.57) v1(47.37,25.59) v1(47.37,24.7) v1(47.75,45) v1(48.39,25.59) v1(48.39,24.7) v1(48.73,45) v1(49.7,45) v1(53.09,36.64) v1(53.09,35.75) v1(54.1,36.64) v1(54.1,35.75) v1(58.55,58.29) v1(59.84,58.29) v1(60.2,11.24) v1(60.2,10.35) v1(60.83,18.73) v1(60.83,17.84) v1(61.21,11.24) v1(61.21,10.35) v1(61.71,32.57) v1(61.85,18.73) v1(61.85,17.84) v1(62.61,57.21) v1(62.61,56.32) v1(63.63,57.21) v1(63.63,56.32) v1(70.48,6.41) v1(70.48,5.52) v1(71.5,6.41) v1(71.5,5.52) v1(76.58,1.59) v1(76.58,0.7) v1(77.6,1.59) v1(77.6,0.7) v1(87.5,8.06) v1(87.5,7.18) v1(88.52,8.06) v1(88.52,7.18)
PGND: length 25.1
  Top Layer w0.914: v1(11.3,17.65) 11.3,14.61 arc(11.6,13.89) 12.32,13.59 arc(13.55,13.08) 14.06,11.85 J2.SH2
  Bottom Layer w0.914: v1(11.3,17.65) 13.72,17.65 arc(14.08,17.8) 14.22,18.16 14.22,23.58 arc(14.17,23.7) J2.SH1 ; TP1.1 13.94,8.14 arc(13.97,8.22) J2.SH2
BOOT0: length 9
  Top Layer w0.254: 33.73,31.51 33.73,32.16 arc(33.76,32.25) 33.84,32.31 37.64,32.31 arc(37.76,32.36) 37.8,32.47 37.8,36.55 arc(37.8,36.56) 37.79,36.56 37.79,36.57
DC: length 144.4
  Top Layer w0.61: U13.3 64,15.23 arc(64.46,15.42) 64.64,15.88 64.64,27.31 arc(64.49,27.66) 64.13,27.81 ; 62.91,27.81 62.49,27.81 arc(62.46,27.83) C41.1
  Top Layer w0.914: K4.1 K3.1 ; K3.1 86.11,34.54 arc(86.64,34.77) 86.87,35.31 86.87,55.12 arc(86.31,56.47) 84.96,57.02 K2.1 K1.1 ; K3.1 arc(77.91,33.71) 78.74,31.7 78.74,28.45 arc(78.55,28) 78.1,27.81 62.91,27.81
  Bottom Layer w0.61: v1(33.6,57.92) v1(32.8,57.92) v1(32,57.92) v1(32,58.93) v1(32.8,58.93) v1(33.6,58.93) 35.31,58.93 arc(35.4,58.97) 35.43,59.06 35.43,59.18 arc(35.51,59.36) 35.69,59.44 69.22,59.44 arc(69.66,59.25) 69.85,58.8 69.85,57.05 arc(69.84,57.03) K1.1
  Bottom Layer w1.27: NOREF#2.67 NOREF#3.65 NOREF.66
ETH_CS: length 38.9
  Top Layer w0.254: U7.25 32.25,43.69 arc(31.81,43.88) v1(31.62,44.32) ; v1(38.61,21.34) arc(38.88,21.22) 38.99,20.95 38.99,16.89 arc(38.88,16.62) 38.61,16.51 36.38,16.51 arc(36.37,16.52) U1.59
  Bottom Layer w0.254: v1(31.62,44.32) 31.62,21.59 31.88,21.34 v1(38.61,21.34)
ETH_INT#: length 21.6
  Top Layer w0.254: U1.49 35.37,21.53 arc(35.23,21.58) 35.18,21.72 arc(35.1,21.9) 34.93,21.97 34.8,21.97 arc(34.44,22.12) 34.29,22.48 v1(34.29,22.99) ; 32.81,40.19 33.85,40.19 arc(34.18,39.92) v1(34.29,39.5)
  Bottom Layer w0.254: v1(34.29,39.5) v1(34.29,22.99)
ETH_RSTI: length 33.2
  Top Layer w0.254: U1.36 44.36,22.4 44.32,22.36 v1(44.32,21.46) ; v1(35.05,38.86) 35.05,41.28 arc(34.93,41.57) 34.63,41.69 U7.29
  Bottom Layer w0.254: v1(35.05,38.86) 35.05,22.61 arc(35.13,22.43) 35.31,22.35 38.74,22.35 arc(39.09,22.2) 39.24,21.84 arc(39.35,21.57) 39.62,21.46 v1(44.32,21.46)
ETH_SCK: length 41.3
  Top Layer w0.254: U1.60 37.49,16.03 37.52,16 39.5,16 arc(39.68,16.08) 39.75,16.26 v1(39.75,20.57) ; 32.81,43.19 31.1,43.19 arc(30.93,43.26) v1(30.86,43.43)
  Bottom Layer w0.254: v1(30.86,43.43) 30.86,21.18 arc(30.93,20.99) 31.1,20.88 32.4,20.57 v1(39.75,20.57)
ETH_SDI: length 52.9
  Top Layer w0.254: v1(35.9,38.1) 35.9,39.33 35.94,39.37 arc(35.9,39.46) 35.81,39.5 arc(35.68,39.55) 35.62,39.69 35.62,40.11 ; 35.62,40.11 35.62,41.86 arc(35.53,42.09) 35.3,42.18 32.95,42.18 ; 35.62,40.11 arc(35.63,40.1) 35.64,40.1 ; v1(32.51,24.38) 29.21,24.38 arc(28.94,24.27) 28.83,24 28.83,15.88 arc(28.98,15.52) 29.34,15.37 35.07,15.37 35.24,15.53 U1.61 40.17,15.53 arc(40.5,15.67) 40.64,16 40.64,16.13 arc(40.6,16.22) v1(40.51,16.26)
  Bottom Layer w0.254: v1(32.51,24.38) 32.38,24.38 arc(32.3,24.42) 32.26,24.51 32.26,39.5 arc(32.5,40.08) 33.09,40.33 35.24,40.33 arc(35.75,39.81) 35.94,39.12 35.9,39.08 v1(35.9,38.1)
ETH_SDO: length 48.4
  Top Layer w0.254: v1(40.51,19.81) 40.89,19.81 arc(41.16,19.7) 41.28,19.43 41.28,15.82 arc(41.04,15.26) 40.49,15.03 36.37,15.03 arc(36.36,15.03) U1.62 ; v1(29.97,44.07) 29.97,43.43 arc(30.19,42.91) 30.71,42.69 U7.27
  Bottom Layer w0.254: v1(40.51,19.81) 30.61,19.81 30.48,19.94 30.48,20.07 arc(30.12,20.21) 29.97,20.57 v1(29.97,44.07)
K11: length 17.4
  Top Layer w0.406: 83.54,53.21 79.63,49.3 79.63,49.28 70.61,49.28 arc(70.07,49.05) 69.85,48.51 69.85,46.89 arc(69.84,46.87) K1.3
K12: length 22.5
  Top Layer w0.406: K1.4 71.5,39.24 arc(71.95,39.43) 72.14,39.88 72.14,47.75 arc(72.32,48.2) 72.77,48.39 83.29,48.39 arc(83.47,48.31) CN1.2
K21: length 12.3
  Top Layer w0.406: K2.3 80.9,46.86 arc(81.53,46.6) 81.79,45.97 81.79,41.91 arc(81.83,41.82) 81.91,41.78 83.39,41.78 arc(83.48,41.82) CN2.1
K22: length 9.8
  Top Layer w0.406: K2.4 82.8,39.24 arc(83.34,39.02) 83.57,38.48 83.57,36.88 arc(83.55,36.84) CN2.2
K31: length 13.1
  Top Layer w0.406: K3.3 80.14,24.38 arc(80.5,24.53) 80.65,24.89 80.65,29.46 arc(80.94,30.18) 81.66,30.48 83.44,30.48 arc(83.51,30.51) CN3.1
K32: length 28.8
  Top Layer w0.406: K3.4 80.65,16.76 arc(80.95,16.69) 81.18,16.47 81.18,12.93 arc(81.39,12.41) 81.91,12.19 85.34,12.19 arc(85.52,12.27) 85.6,12.45 85.6,25.02 arc(85.45,25.38) 85.09,25.53 83.57,25.53 arc(83.55,25.52) CN3.2
K41: length 18.8
  Top Layer w0.406: K4.3 69.82,19.58 arc(69.98,19.21) 70.36,19.05 83.51,19.05 arc(83.53,19.06) CN4.1
K42: length 19.1
  Top Layer w0.406: K4.4 69.82,17.63 arc(70.02,18.09) 70.49,18.29 81.03,18.29 arc(81.56,18.06) 81.79,17.53 81.79,14.22 arc(81.94,13.86) 82.3,13.72 83.26,13.72 arc(83.46,13.8) CN4.2
LINK#: length 51.6
  Top Layer w0.254: U1.52 37.75,20.03 arc(37.82,20) 37.85,19.94 37.85,18.03 arc(37.96,17.76) v1(38.23,17.65) ; v1(29.59,12.06) v1(29.59,6.99)
  Bottom Layer w0.254: v1(38.23,17.65) 38.23,12.45 arc(38.08,12.09) 37.72,11.94 29.72,11.94 arc(29.63,11.98) v1(29.59,12.06) ; v1(29.59,6.99) 17.14,6.99 arc(16.7,7.17) 16.51,7.62 16.51,10.79 arc(16.03,11.96) 14.86,12.45 6.64,12.45 arc(6.26,12.29) J2.11
M_C: length 92.9
  Top Layer w0.254: v1(27.81,32) 27.81,36.19 arc(28.01,36.68) 28.5,36.88 29.2,36.88 arc(30.72,37.51) 31.34,39.02 arc(31.5,39.15) 31.7,39.19 32.81,39.19 ; v1(50.04,8) 50.04,0.76 arc(50.11,0.58) 50.29,0.51 68.96,0.51 arc(69.41,0.69) 69.6,1.14 69.6,4.19 arc(69.74,4.55) 70.1,4.7 72.39,4.7 arc(72.48,4.74) 72.52,4.83 72.52,7.73 arc(72.53,7.76) R13.2
  Bottom Layer w0.254: v1(50.04,8) 50.04,10.29 arc(49.74,11.01) 49.02,11.3 28.57,11.3 arc(28.04,11.53) 27.81,12.06 v1(27.81,32)
M_D: length 61.4
  Top Layer w0.254: R12.2 58.42,7.37 arc(58.06,7.51) 57.91,7.87 v1(57.91,22.86) ; U7.37 34.31,35.67 arc(34.82,34.42) 36.07,33.91 v1(36.07,34.16)
  Bottom Layer w0.254: v1(36.07,34.16) 36.07,23.75 arc(36.33,23.12) 36.96,22.86 v1(57.91,22.86)
M_DIR: length 29.2
  Top Layer w0.254: 15.06,35.45 15.06,34.59 arc(15.11,34.47) 15.24,34.42 22.35,34.42 arc(22.53,34.34) 22.61,34.16 22.61,32.64 arc(22.68,32.46) 22.86,32.39 24.33,32.39 arc(24.37,32.37) U11.3 ; U7.33 31.06,39.69 arc(30.96,39.67) 30.89,39.59 arc(30.23,38) 28.63,37.34 27.31,37.34 arc(27.04,37.23) 26.92,36.96 v1(26.92,31.56)
  Bottom Layer w0.254: v1(22.67,31.56) v1(26.92,31.56)
  vias: v1(22.67,30.78)
M_IO_PA4: length 91.2
  Top Layer w0.254: 39.28,45.35 39.28,47.21 arc(39.56,47.9) 40.25,48.18
  Bottom Layer w0.254: v1(40.23,48.18) 40.23,52.95 arc(40.29,53.16) 40.46,53.3 61.95,53.3 arc(62.45,53.1) 62.65,52.6 62.65,8.65 arc(62.34,7.9) 61.59,7.59 54.54,7.59 arc(53.98,7.36) 53.75,6.8 53.75,2.01 arc(53.66,1.8) 53.44,1.71 52.63,1.71 arc(52.62,1.72) 52.62,1.72
M_IO_PA5: length 95.5
  Top Layer w0.254: 38.79,45.41 38.79,46.96 arc(38.42,47.85) 37.53,48.22
  Bottom Layer w0.254: 55.43,1.68 arc(55.45,1.72) 55.48,1.73 55.99,1.73 arc(56.21,1.82) 56.3,2.04 56.3,6.6 arc(56.45,6.96) 56.8,7.1 62.66,7.1 arc(63.03,7.26) 63.19,7.63 63.19,53.24 arc(62.86,53.62) 62.37,53.76 36.74,53.76 arc(36.53,53.53) 36.45,53.23 36.45,48.52 arc(36.51,48.49) 36.59,48.47 37.27,48.47 arc(37.47,48.39) v1(37.55,48.19)
M_IO_PA6: length 95.6
  Top Layer w0.254: 38.31,45.19 38.31,47.16 arc(38.21,47.4) 37.97,47.5 36.7,47.5 arc(36.51,47.61) v1(36.43,47.82)
  Bottom Layer w0.254: v1(36.43,47.82) 36.3,47.82 arc(36.09,47.91) 36,48.12 36,53.84 arc(36.11,54.11) 36.37,54.22 62.95,54.22 arc(63.44,54.01) 63.64,53.52 63.64,7.08 arc(63.5,6.74) 63.17,6.6 59.47,6.6 arc(59.03,6.42) 58.85,5.98 58.85,2.07 arc(58.75,1.83) 58.51,1.73 58.19,1.73 arc(58.12,1.76) 58.09,1.83
M_IO_PA7: length 96
  Top Layer w0.254: 37.81,45.19 37.81,46.27 arc(37.6,46.78) 37.08,46.99 35.81,46.99 arc(35.72,47.03) 35.69,47.12 35.81,47.12 v1(35.81,47.24)
  Bottom Layer w0.254: v1(35.81,47.24) arc(35.61,47.33) 35.52,47.54 35.52,54.38 arc(35.61,54.59) 35.82,54.68 63.02,54.68 arc(63.97,54.29) 64.36,53.34 64.36,6.99 arc(64.09,6.34) 63.45,6.07 61.7,6.07 arc(61.45,5.97) 61.35,5.72 61.35,1.96 arc(61.28,1.79) 61.11,1.72 60.38,1.72 arc(60.36,1.73) 60.36,1.74
M_IO_PB1: length 61.3
  Top Layer w0.254: 36.81,45.19 36.81,42.78 arc(36.78,42.7) 36.7,42.67 v1(36.83,42.67) ; v1(49.73,35.73) 49.73,24.16 arc(49.83,23.91) 50.09,23.8 55.13,23.8 arc(55.32,23.72) 55.4,23.53 55.4,6.53 arc(55.33,6.35) 55.15,6.27 52.95,6.27 arc(52.65,6.14) 52.52,5.83 52.52,5.13 arc(52.58,4.98) 52.73,4.92
  Bottom Layer w0.254: 37.19,42.58 39.35,42.58 arc(40.14,42.25) 40.46,41.47 40.46,35.93 arc(40.55,35.64) 40.78,35.44 49.55,35.44 arc(49.64,35.48) 49.68,35.57 49.68,35.68 arc(49.69,35.71) v1(49.73,35.73) ; 37.19,42.58 37.18,42.59 37.17,42.59 ; 37.19,42.58 arc(37.2,42.58) 37.22,42.58 ; 37.19,42.58 arc(37.18,42.58) 37.17,42.59 ; v1(36.83,42.67) 37.08,42.67 arc(37.14,42.65) 37.17,42.59
M_IO_PB2: length 61.4
  Top Layer w0.254: 36.33,45.06 36.33,43.37 arc(36.17,42.99) v1(35.79,42.83) ; v1(50.66,35.14) 50.66,24.42 arc(50.69,24.32) 50.78,24.26 55.92,24.26 arc(55.96,24.24) 55.98,24.2 55.98,6.38 arc(55.75,5.84) 55.21,5.62 arc(55.06,5.56) 55,5.41 55,5.14 arc(55.01,5.14) 55.01,5.13 55.01,4.93 arc(54.97,4.83) 54.88,4.79
  Bottom Layer w0.254: v1(35.79,42.83) arc(35.56,42.74) 35.47,42.51 35.47,42.2 arc(35.46,42.17) 35.43,42.16 ; 50.65,35.14 arc(50.61,35.03) 50.5,34.99 40.61,34.99 arc(40.18,35.16) 40,35.59 40,41.17 arc(39.79,41.68) 39.29,41.89 35.69,41.89 arc(35.53,41.96) 35.46,42.12
M_IO_PB10: length 62.5
  Top Layer w0.254: 35.81,45.04 35.81,44.19 arc(35.52,43.49) 34.83,43.21 34.83,43.11 arc(34.84,43.08) v1(34.88,43.06) ; v1(51.61,34.49) 51.61,25.12 arc(51.68,24.93) 51.88,24.85 56.17,24.85 arc(56.48,24.73) 56.6,24.42 56.6,5.36 arc(56.83,4.81) 57.38,4.58
  Bottom Layer w0.254: 34.84,41.44 34.84,43.02 arc(34.85,43.05) v1(34.88,43.06) ; 51.65,34.48 arc(51.65,34.48) 51.65,34.48 40.34,34.48 arc(39.72,34.73) 39.47,35.35 39.47,40.96 arc(39.34,41.26) 39.04,41.39 34.94,41.39 arc(34.86,41.42) 34.82,41.5
M_IO_PB11: length 66.4
  Top Layer w0.254: 35.29,45.2 35.29,44.2 arc(35.21,44.02) 35.03,43.94 34.24,43.94 34.24,43.78 arc(34.23,43.76) v1(34.21,43.76) ; v1(52.6,33.71) 52.6,25.73 arc(52.69,25.51) 52.91,25.42 56.79,25.42 arc(57,25.33) 57.08,25.13 57.08,6.1 arc(57.21,5.78) 57.53,5.65 59.72,5.65 arc(59.94,5.56) 60.03,5.34 60.03,4.78
  Bottom Layer w0.254: 34.34,40.79 34.34,40.78 38.62,40.78 arc(38.84,40.69) 38.93,40.47 38.93,33.95 arc(38.99,33.81) 39.13,33.75 52.57,33.75 arc(52.59,33.74) v1(52.6,33.71) ; v1(34.21,43.76) 34.21,41 arc(34.27,40.85) 34.42,40.79
M_K1: length 17.7
  Top Layer w0.254: U7.10 43.33,42.69 arc(43.4,42.73) 43.43,42.8 43.43,47.75 arc(43.47,47.84) 43.56,47.88 arc(43.64,48.06) 43.81,48.13 51.31,48.13 arc(51.58,48.24) 51.69,48.51 51.69,48.77 arc(51.99,49.49) 52.71,49.78
M_K2: length 17.3
  Top Layer w0.254: v1(44.2,47.37) 53.3,47.37 arc(53.62,47.24) U9.4 ; 41.31,43.19 42.69,43.19 arc(42.85,43.23) 42.98,43.34 42.98,47.07 arc(42.89,47.28) v1(42.67,47.37)
  Bottom Layer w0.254: v1(42.67,47.37) v1(44.2,47.37)
M_K3: length 16
  Top Layer w0.254: 52.71,45.21 52.32,45.21 arc(51.96,45.36) 51.82,45.72 51.82,46.23 arc(51.7,46.5) 51.44,46.61 v1(45.09,46.61) ; U7.12 42.3,43.69 arc(42.43,43.73) 42.52,43.83 42.52,46.13 arc(42.38,46.47) v1(42.04,46.61)
  Bottom Layer w0.254: v1(42.04,46.61) v1(45.09,46.61)
M_K4: length 21.5
  Top Layer w0.254: 39.84,45.51 39.84,46.24 ; 39.84,46.24 arc(39.99,46.61) v1(40.36,46.77) ; 39.84,46.24 arc(39.99,46.61) v1(40.36,46.77) ; 39.84,46.24 arc(39.99,46.61) v1(40.36,46.77) ; 39.84,46.24 arc(39.99,46.61) v1(40.36,46.77) ; v1(46.1,45.85) 51.05,45.85 arc(51.23,45.77) 51.31,45.59 51.31,45.08 arc(51.38,44.91) 51.56,44.83 51.69,44.83 arc(51.87,44.76) 51.94,44.58 51.94,43.18 arc(51.98,43.09) 52.07,43.05 53.7,43.05 arc(53.74,43.07) U9.7
  Bottom Layer w0.254: v1(40.36,46.77) 39.82,46.77 arc(39.79,46.76) 39.78,46.73 ; v1(46.1,45.85) 40.7,45.85 arc(40.06,46.11) 39.78,46.73 ; 39.78,46.73 arc(39.78,46.74) 39.78,46.75 ; 39.78,46.73 arc(39.78,46.73) 39.78,46.72
M_KC1: length 14.1
  Top Layer w0.406: U9.16 69.14,50.72 arc(69.64,50.93) 69.85,51.44 69.85,54.46 arc(69.84,54.48) 69.82,54.48
M_KC2: length 22.4
  Top Layer w0.406: U9.14 67.23,48.18 arc(67.92,48.47) 68.2,49.15 68.2,49.53 arc(68.31,49.8) 68.58,49.91 75.82,49.91 arc(75.91,49.95) 75.95,50.04 75.95,54.43 arc(75.93,54.47) 75.9,54.48
M_KC3: length 28.7
  Top Layer w0.305: U9.12 64.47,45.64 arc(65.49,45.22) 65.91,44.2 65.91,34.42 arc(66.25,33.61) 67.06,33.27 74.62,33.27 arc(75.52,32.9) K3.2
M_KC4: length 21.3
  Top Layer w0.406: K4.2 65.91,32 arc(65.52,32.17) 65.35,32.56 65.35,42.93 arc(65.12,43.06) 64.85,43.1 U9.10
M_RST#: length 16.3
  Top Layer w0.254: v1(42.04,51.44) 43.5,51.44 arc(43.51,51.44) R11.1 ; 41.31,41.19 39.45,41.19 arc(39.3,41.26) 39.24,41.4 39.24,43.81 arc(39.15,43.85) v1(39.12,43.94)
  Bottom Layer w0.254: v1(39.12,43.94) 39.12,46.86 arc(39.3,47.31) 39.75,47.5 41.78,47.5 arc(41.96,47.57) 42.04,47.75 v1(42.04,51.44)
M_RXD: length 24.2
  Top Layer w0.254: 32.69,40.71 30.56,40.71 arc(30.49,40.7) 30.43,40.66 30.43,40.2 arc(29.79,38.66) 28.25,38.02 26.57,38.02 arc(26.38,37.98) 26.24,37.85 26.24,30.42 arc(26.09,30.06) 25.72,29.91 24.79,29.91 arc(24.75,29.89) 24.74,29.85 ; 18.73,28.28 20.28,28.28 arc(20.53,28.39) 20.63,28.63 20.63,29.49 arc(20.73,29.72) 20.96,29.81 24.21,29.81
M_SCL: length 62.4
  Top Layer w0.254: 36.81,36.95 36.81,37.87 arc(36.78,37.94) 36.7,37.97 arc(36.61,38.01) 36.58,38.1 36.58,38.5 arc(36.57,38.52) 36.54,38.53 36.54,41.85 arc(36.58,41.93) 36.67,41.97 37.4,41.97 arc(37.49,42) 37.53,42.09 37.53,43.44 arc(37.53,43.45) v1(37.54,43.45) ; 36.81,36.95 U7.42 ; 36.81,36.95 arc(36.82,36.94) 36.83,36.93 36.83,33.78 arc(36.68,33.42) 36.32,33.27 29.84,33.27 arc(29.49,33.13) 29.34,32.77 29.34,31.76 ; U10.6 48.16,56.11 arc(47.51,56.38) 47.24,57.02 47.24,57.98 arc(47.25,57.99) OLED1.3
  Bottom Layer w0.254: v1(37.54,43.45) 37.54,44.38 arc(37.44,44.61) 37.21,44.7 32.51,44.7 arc(32.15,44.85) 32,45.21 32,55.88 arc(32.19,56.33) 32.64,56.52 46.74,56.52 arc(47.1,56.66) 47.24,57.02 47.24,57.98 arc(47.25,57.99) OLED1.3
M_SDA: length 60.6
  Top Layer w0.254: U10.5 50.43,57.38 arc(49.99,57.56) OLED1.4 ; v1(38.43,43.24) arc(38.3,43.19) 38.25,43.07 38.25,41.76 arc(38.1,41.39) 37.72,41.23 arc(37.45,41.12) 37.34,40.85 37.34,36.67 arc(37.33,36.69) U7.43 37.31,32.99 arc(37.24,32.83) 37.08,32.77 33.27,32.77 arc(33.09,32.69) 33.02,32.51 33.02,29.84 arc(32.91,29.58) 32.64,29.46 31.83,29.46 arc(31.8,29.48) R14.1
  Bottom Layer w0.254: v1(38.43,43.24) 38.43,43.87 arc(38.24,44.52) 37.72,44.97 arc(37.48,45.11) 37.21,45.16 32.94,45.16 arc(32.67,45.24) 32.46,45.44 32.46,55.58 arc(32.54,55.85) 32.74,56.06 49.07,56.06 arc(49.58,56.27) 49.78,56.77 49.78,57.98 arc(49.79,57.99) OLED1.4
M_TXD: length 22
  Top Layer w0.254: R17.1 25.39,35.45 arc(25.67,35.33) 25.78,35.05 ; 25.78,35.05 25.78,37.85 arc(25.97,38.3) 26.42,38.48 28.25,38.48 arc(29.47,38.98) 29.97,40.2 29.97,41.02 arc(30.02,41.14) 30.15,41.19 32.81,41.19 ; 25.78,35.05 25.78,33.91 arc(25.71,33.73) 25.53,33.66 24.43,33.66 arc(24.4,33.64) U11.4
M_X1: length 8.8
  Top Layer w0.254: 41.31,40.19 45.4,40.19 45.49,40.11 C33.2 47.79,39.36 arc(48.5,39.07) U8.2
M_X2: length 8.8
  Top Layer w0.254: U7.6 45.4,40.69 45.49,40.78 C34.2 47.9,41.57 arc(48.53,41.83) U8.1
RXN: length 27.6
  Top Layer w0.254: v1(25.27,9.27) 25.27,10.57 arc(25.3,10.63) R3.1 ; U1.5 40.36,10.04 arc(40.24,9.75) v1(39.96,9.64)
  Top Layer w0.406: J2.6 21.59,14.1 arc(21.77,14.02) 21.84,13.84 21.84,11.05 arc(21.99,10.69) 22.35,10.54 25.25,10.54 arc(25.26,10.54) 25.27,10.54
  Bottom Layer w0.254: v1(39.96,9.64) 25.64,9.64 arc(25.38,9.53) v1(25.27,9.27)
RXP: length 31.1
  Top Layer w0.254: U1.4 39.86,10.65 arc(39.79,10.48) v1(39.62,10.41) ; v1(25.27,12.06) 25.27,13.36 arc(25.3,13.42) R5.1
  Top Layer w0.406: J2.3 21.97,17.91 arc(22.33,17.76) 22.48,17.4 22.48,13.72 arc(22.55,13.54) 22.73,13.46 25.35,13.46 arc(25.36,13.46) R5.1
  Bottom Layer w0.254: v1(25.27,12.06) 25.27,11.05 arc(25.46,10.6) 25.91,10.41 v1(39.62,10.41)
S_CTRL: length 49.1
  Top Layer w0.254: v1(58.42,23.75) 59.82,23.75 arc(59.91,23.71) 59.94,23.62 59.94,21.84 ; U7.38 34.81,35.42 arc(34.88,35.25) 35.05,35.18 v1(35.81,35.18) ; 59.94,21.84 59.94,15.51 arc(60.02,15.32) U13.4 ; 59.94,21.84 arc(60.06,21.57) 60.32,21.46 62.42,21.46 arc(62.45,21.48) R23.2
  Bottom Layer w0.254: 36.83,24.26 36.83,34.8 arc(36.72,35.07) 36.45,35.18 v1(35.81,35.18) ; 36.83,24.26 arc(36.94,24.19) 36.98,24.06 ; 36.83,24.26 arc(36.9,24.16) 36.98,24.06 ; v1(58.42,23.75) 37.72,23.75 arc(37.32,23.83) 36.98,24.06
SEN_OUT: length 112.6
  Top Layer w0.254: 37.31,45.19 37.31,46.13 arc(37.21,46.38) 36.96,46.48 35.18,46.48 arc(35.09,46.58) v1(35.06,46.72) ; v1(35.05,55.12) 49.91,55.12 arc(50.36,54.93) 50.55,54.48 50.55,53.21 arc(50.77,52.67) 51.31,52.45 54.99,52.45 arc(55.26,52.34) 55.37,52.07 55.37,28.96 arc(55.3,28.78) 55.12,28.7 53.47,28.7 arc(53.29,28.63) 53.21,28.45 53.21,26.03 arc(53.23,25.95) 53.27,25.88 63.53,25.88 arc(63.78,25.77) 63.88,25.53 63.88,16 arc(63.84,15.91) 63.75,15.88 62.23,15.88 arc(61.87,15.73) 61.72,15.37 61.72,12.32 arc(61.8,12.14) 61.98,12.06 69.46,12.06 arc(69.47,12.07) 69.47,12.07
  Top Layer w0.61: 69.47,10.62 69.47,13.47 arc(69.47,13.48) C39.1 ; 69.47,10.62 69.47,9.65 arc(69.62,9.29) 69.98,9.14 78.87,9.14 arc(79.37,8.94) 79.58,8.43 79.58,7.11 ; 69.47,10.62 arc(69.49,10.67) R22.1
  Bottom Layer w0.254: v1(35.06,46.72) 35.06,55.11 v1(35.05,55.12)
TXN: length 38.5
  Top Layer w0.254: v1(23.62,15.62) 23.62,16.13 arc(23.58,16.22) 23.5,16.26 ; U1.8 41.86,8.04 arc(41.86,8.02) v1(41.84,8.01)
  Top Layer w0.406: J2.2 22.48,19.18 arc(22.93,18.99) 23.11,18.54 23.11,16.64 arc(23.23,16.37) 23.5,16.26 25.35,16.26 arc(25.36,16.25) R8.1
  Bottom Layer w0.254: v1(23.62,15.62) 23.62,8.38 arc(23.77,8.02) 24.13,7.87 41.7,7.87 arc(41.8,7.91) v1(41.84,8.01)
TXP: length 39.8
  Top Layer w0.254: v1(24.38,17.53) 24.38,18.8 arc(24.35,18.89) 24.26,18.92 ; U1.7 41.36,8.94 arc(41.25,8.68) v1(40.99,8.57)
  Top Layer w0.406: J2.1 23.36,20.45 arc(23.73,20.3) 23.88,19.94 23.88,19.3 arc(23.99,19.03) 24.26,18.92 25.26,18.92 arc(25.34,18.95) R9.1
  Bottom Layer w0.254: v1(24.38,17.53) 24.38,8.8 arc(24.45,8.64) 24.62,8.57 v1(40.99,8.57)
V_HU: length 37
  Top Layer w0.61: U13.1 64.52,13.33 arc(64.7,13.41) 64.77,13.59 64.77,14.22 arc(64.99,14.76) 65.53,14.99 74.42,14.99 arc(74.66,14.89) 74.76,14.65 C40.2 C42.2 arc(74.77,10.66) 74.8,10.67 84.71,10.67 arc(85.43,10.37) 85.72,9.65 85.72,4.57 arc(85.56,4.18) 85.17,4.01 U12.1
XI: length 10.9
  Top Layer w0.254: U1.10 42.86,5.93 42.77,5.84 C16.2 41.64,3.24 arc(41.47,2.84) 41.07,2.67
XO: length 10.9
  Top Layer w0.254: U1.11 43.36,5.93 43.45,5.84 C17.2 44.59,3.24 arc(44.76,2.83) 45.17,2.67
$1N6890: length 6.6
  Top Layer w0.254: U1.1 38.36,11.31 arc(38.25,11.04) 37.97,10.92 33.44,10.92 arc(33.1,11.07) R4.1
$1N7627: length 4.5
  Top Layer w0.254: R1.1 33.55,18.9 arc(34.34,18.58) 34.67,17.78 arc(34.89,17.25) 35.42,17.03 U1.58
$1N10654: length 11.7
  Top Layer w0.406: R2.1 21.72,5.08 arc(21.36,5.23) 21.21,5.59 21.21,11.43 arc(21.17,11.52) 21.08,11.56 J2.8
$1N10919: length 37.2
  Top Layer w0.406: 6.11,9.12 7.9,9.12 arc(9.05,8.64) 9.53,7.49 arc(9.93,6.51) 10.92,6.1 19.81,6.1 arc(20.08,5.98) 20.19,5.72 20.19,2.79 arc(20.23,2.7) 20.32,2.67 29.34,2.67 arc(29.43,2.7) 29.46,2.79 29.46,5.84 arc(29.35,6.11) 29.08,6.22 25.4,6.22 arc(25.31,6.26) 25.27,6.35 25.27,7.52 arc(25.3,7.59) 25.37,7.62
$1N10952: length 24
  Top Layer w0.406: J2.9 8.49,22.62 arc(8.77,22.51) 8.89,22.22 8.89,20.45 arc(9.15,19.82) 9.78,19.56 13.21,19.56 arc(13.57,19.71) 13.72,20.07 13.72,21.46 arc(13.9,21.91) 14.35,22.1 25.08,22.1 arc(25.28,22.02) R6.1
$2N5291: length 9.2
  Top Layer w0.61: 69.28,7.62 69.28,5.65 arc(69.11,5.25) 68.71,5.08 66.29,5.08 arc(65.93,4.93) 65.79,4.57 65.79,1.55 arc(65.81,1.5) 65.86,1.47
$2N5344: length 7.2
  Top Layer w0.61: R13.1 74.56,1.79 arc(74.52,1.69) 74.42,1.65 73.56,1.65 arc(73.5,1.67) H1.4

## Copper pours and planes (outline as drawn; the poured copper is in the pictures)
1V8 on Top Layer: 13.71,44.04 29.59,44.04 29.59,39.76 13.71,39.76
3V3 on Top Layer: 38.92,35.32 43.63,35.32 43.63,33.33 38.92,33.33
3V3 on Top Layer: 15.49,57.67 30.99,57.67 30.99,43.18 15.49,43.18
3V3 on Top Layer: 43.96,50.19 47.01,50.19 47.01,48.74 43.96,48.74
3V3 on Top Layer: 28.15,50.79 44.7,50.79 44.7,48.73 28.15,48.73
3V3 on Top Layer: 17.89,38.36 21.61,38.36 21.61,36.78 17.89,36.78
3V3 on Top Layer: 26.42,30.51 30.48,30.51 30.48,6.73 26.42,6.73
3V3 on Top Layer: 13.48,17.49 21.1,17.49 21.1,13.84 13.48,13.84
3V3 on Top Layer: 14.62,30.18 20.05,30.18 20.05,25.47 14.62,25.47
3V3 on Bottom Layer: 14.4,38.29 21.58,38.29 21.58,28.2 14.4,28.2
GND on Top Layer: 11.37,27.2 16.92,27.2 16.92,25.34 11.37,25.34
GND on Top Layer: -9.4,66.67 95.25,66.67 95.25,-9.4 -9.4,-9.4
GND on Top Layer: 57.91,58.94 60.61,58.94 60.61,52.58 57.91,52.58
GND on Bottom Layer: -14.99,67.69 105.41,67.69 105.41,-9.65 -14.99,-9.65
DC on Top Layer: 58.17,42.55 63.3,42.55 63.3,26.59 58.17,26.59
DC on Top Layer: 12.32,59.54 34,59.54 34,47.15 12.32,47.15
LINK# on Top Layer: 4.7,21.34 7.62,21.34 7.62,10.54 4.7,10.54
M_DIR on Top Layer: 22.1,32.76 25.78,32.76 25.78,30.35 22.1,30.35
M_K1 on Top Layer: 52.4,51.18 54.97,51.18 54.97,48.89 52.4,48.89
M_K2 on Top Layer: 52.32,48.67 54.97,48.67 54.97,46.28 52.32,46.28
M_K3 on Top Layer: 52.32,46.06 54.97,46.06 54.97,43.77 52.32,43.77
M_KC1 on Top Layer: 58.01,51.33 60.45,51.33 60.45,48.89 58.01,48.89
M_KC2 on Top Layer: 58.01,48.64 60.5,48.64 60.5,46.48 58.01,46.48
M_KC3 on Top Layer: 58.01,46.17 60.61,46.17 60.61,43.81 58.01,43.81
M_RST# on Top Layer: 42.59,52.31 49.15,52.31 49.15,50.45 42.59,50.45
$2N14954 on Top Layer: 3.17,31.47 20.09,31.47 20.09,27.42 3.17,27.42
$2N14989 on Top Layer: 3.17,36.45 20.57,36.45 20.57,31.77 3.17,31.77

Small or netless copper shapes (teardrops, artwork), in the pictures only: 319 on Top Layer, 78 on Bottom Layer

## Text on the board
Top Silkscreen Layer: PA5 | PA6 | PA7 | 3V3 | GND | GDN | SCL | SDA | PA14 | PA13 | PA4 | PB1 | PB2 | PB10 | PB11
